# Altium project SUBSYSTEM_A.PrjPcb
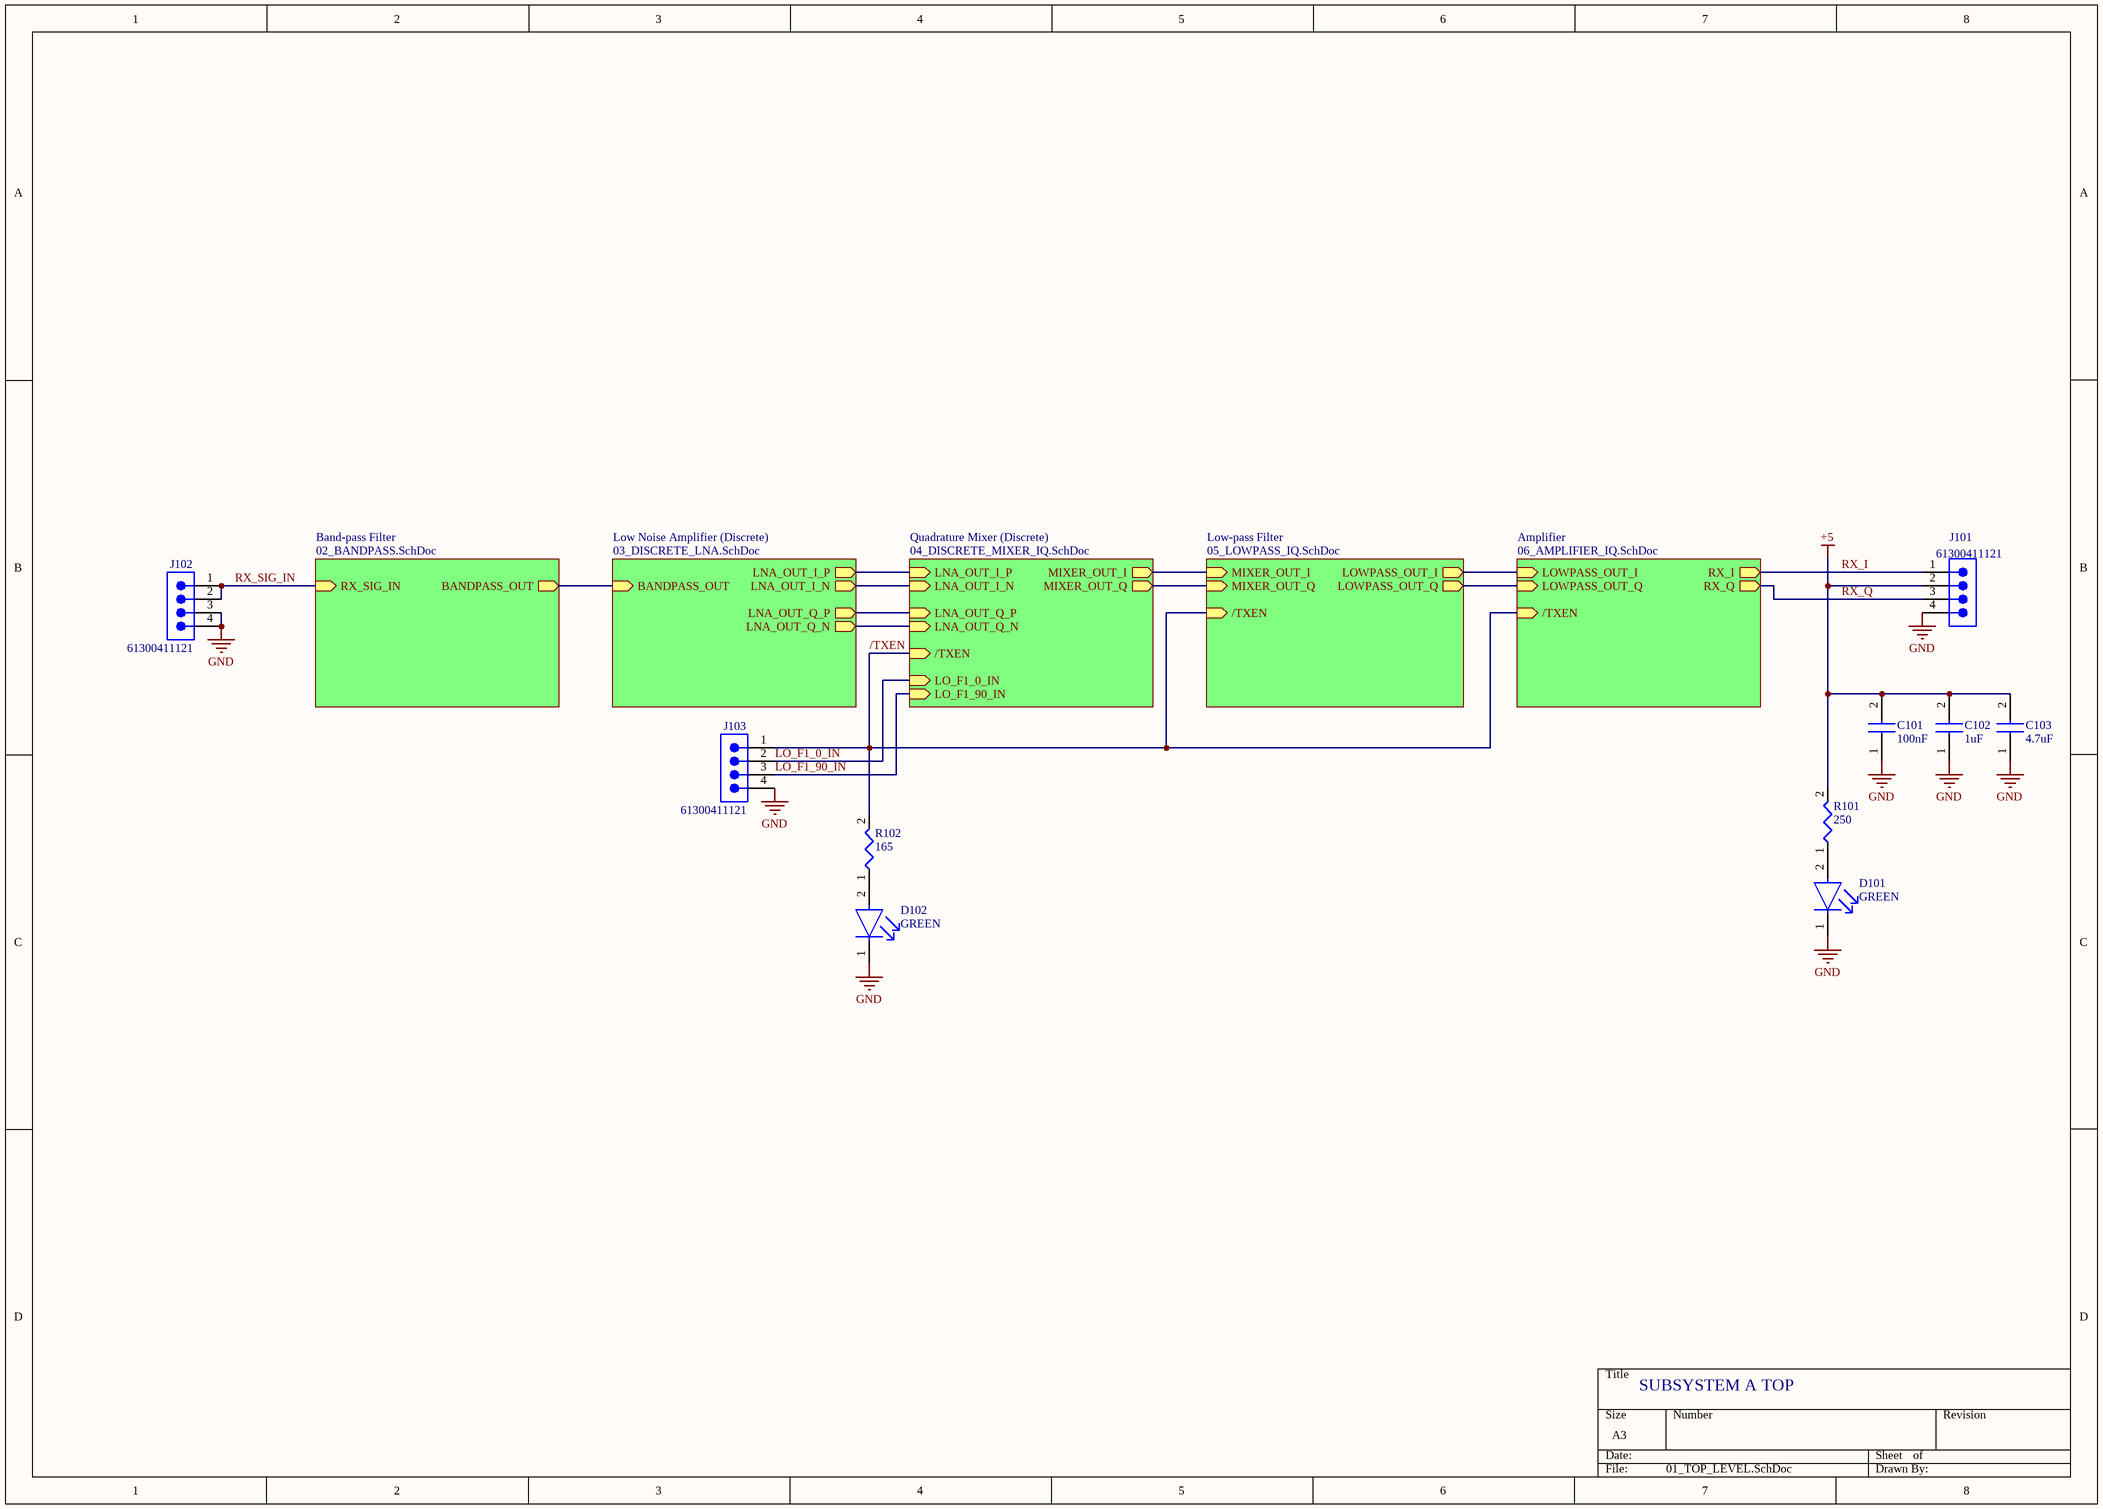
[diagram p0: 01_TOP_LEVEL.SchDoc]
6 sheets, 152 parts. Net scope: hierarchical (ports join the sheet entries above them; power ports are global).
Board file: PCB1.PcbDoc
Sheets:
  01_TOP_LEVEL.SchDoc
    Band-pass Filter = 02_BANDPASS.SchDoc
    Low Noise Amplifier (Discrete) = 03_DISCRETE_LNA.SchDoc
    Quadrature Mixer (Discrete) = 04_DISCRETE_MIXER_IQ.SchDoc
    Low-pass Filter = 05_LOWPASS_IQ.SchDoc
    Amplifier = 06_AMPLIFIER_IQ.SchDoc

## Sheet 01_TOP_LEVEL.SchDoc
size A3; SheetNumber: 1; SheetTotal: 6

### Parts
C101  100nF  [CAP_0805]
C102  1uF  [CAP_0805]
C103  4.7uF  [CAP_0805]
D101  GREEN  [FP-LTST-C170GKT-MFG]
D102  GREEN  [FP-LTST-C170GKT-MFG]
J101  61300411121  [61300411121]
J102  61300411121  [61300411121]
J103  61300411121  [61300411121]
R101  250  [RES_0805]
R102  165  [RES_0805]

### Sub-sheets
Amplifier = 06_AMPLIFIER_IQ.SchDoc: LOWPASS_OUT_I (in), LOWPASS_OUT_Q (in), RX_I (out), RX_Q (out), /TXEN (in)
Band-pass Filter = 02_BANDPASS.SchDoc: BANDPASS_OUT (out), RX_SIG_IN (in)
Low Noise Amplifier (Discrete) = 03_DISCRETE_LNA.SchDoc: BANDPASS_OUT (in), LNA_OUT_I_P (out), LNA_OUT_I_N (out), LNA_OUT_Q_P (out), LNA_OUT_Q_N (out)
Low-pass Filter = 05_LOWPASS_IQ.SchDoc: MIXER_OUT_I (in), MIXER_OUT_Q (in), /TXEN (in), LOWPASS_OUT_I (out), LOWPASS_OUT_Q (out)
Quadrature Mixer (Discrete) = 04_DISCRETE_MIXER_IQ.SchDoc: LNA_OUT_I_P (in), LNA_OUT_I_N (in), LNA_OUT_Q_P (in), LNA_OUT_Q_N (in), MIXER_OUT_I (out), MIXER_OUT_Q (out), LO_F1_0_IN (in), LO_F1_90_IN (in), /TXEN (in)

### Nets
+5: C101.2 C102.2 C103.2 J101.2 R101.2
GND: C101.1 C102.1 C103.1 D101.1(C) D102.1(C) J101.4 J102.3 J102.4 J103.4
/TXEN: J103.1 R102.2 ; sheet Quadrature Mixer (Discrete)//TXEN, sheet Low-pass Filter//TXEN, sheet Amplifier//TXEN
BANDPASS_OUT: sheet Band-pass Filter/BANDPASS_OUT, sheet Low Noise Amplifier (Discrete)/BANDPASS_OUT
LNA_OUT_I_N: sheet Low Noise Amplifier (Discrete)/LNA_OUT_I_N, sheet Quadrature Mixer (Discrete)/LNA_OUT_I_N
LNA_OUT_I_P: sheet Low Noise Amplifier (Discrete)/LNA_OUT_I_P, sheet Quadrature Mixer (Discrete)/LNA_OUT_I_P
LNA_OUT_Q_N: sheet Low Noise Amplifier (Discrete)/LNA_OUT_Q_N, sheet Quadrature Mixer (Discrete)/LNA_OUT_Q_N
LNA_OUT_Q_P: sheet Low Noise Amplifier (Discrete)/LNA_OUT_Q_P, sheet Quadrature Mixer (Discrete)/LNA_OUT_Q_P
LO_F1_0_IN: J103.2 ; sheet Quadrature Mixer (Discrete)/LO_F1_0_IN
LO_F1_90_IN: J103.3 ; sheet Quadrature Mixer (Discrete)/LO_F1_90_IN
LOWPASS_OUT_I: sheet Low-pass Filter/LOWPASS_OUT_I, sheet Amplifier/LOWPASS_OUT_I
LOWPASS_OUT_Q: sheet Low-pass Filter/LOWPASS_OUT_Q, sheet Amplifier/LOWPASS_OUT_Q
MIXER_OUT_I: sheet Quadrature Mixer (Discrete)/MIXER_OUT_I, sheet Low-pass Filter/MIXER_OUT_I
MIXER_OUT_Q: sheet Quadrature Mixer (Discrete)/MIXER_OUT_Q, sheet Low-pass Filter/MIXER_OUT_Q
RX_I: J101.1 ; sheet Amplifier/RX_I
RX_Q: J101.3 ; sheet Amplifier/RX_Q
RX_SIG_IN: J102.1 J102.2 ; sheet Band-pass Filter/RX_SIG_IN
NetD101_2: D101.2(A) R101.1
NetD102_2: D102.2(A) R102.1

### Notes on the sheet
- SUBSYSTEM A TOP

### Library data of the parts
C101-C103 = CAP_0805: Capacitor SMD 0805; Height: 0.94mm
D101 D102 = CMP-1674-00002-6: LED GREEN CLEAR SMD; Dominant Wavelength: 569nm; Lens Style: Diffused; Forward Voltage: 2.1V; Number of Elements: 1; Wavelength: 565nm; Luminous Intensity: 6mcd; Test Current: 10mA; Power Dissipation: 100mW; Reverse Voltage: 5V; Forward Current: 30mA; Viewing Angle: 130°; Lens Color: Colorless; Min Operating Temperature: -55°C; Number of Pins: 2; Max Operating Temperature: 85°C; Color: Green; Radiation Hardening: No; Illumination Color: Green; Case Code (Metric): 2012; Lens Transparency: Clear; Case/Package: 0805; Width: 1.25mm; Case Code (Imperial): 0805; Package Quantity: 1; Height: 1.1mm; Depth: 1.25mm; Length: 2mm; Power Rating: 100mW; Lead Free: Lead Free; Number of LEDs: 1; Packaging: Tape and Reel; Mount: Surface Mount; Voltage: 5V; ComponentLink1Description: DigiKey; ComponentLink1URL: https://www.digikey.ca/en/products/detail/liteon/LTST-C170GKT/269226
J101-J103 = CMP-1502-01064-4: THT Vertical Pin Header WR-PHD, Pitch 2.54 mm, Single Row, 4 pins; Connector Type: Male Pin; Gender: Male; Current Rating: 3A; Number of Positions: 4; Operating Supply Voltage: 250V; Contact Resistance: 20mΩ; Pitch: 2.54mm; Max Operating Temperature: 105°C; Mount: Through Hole; Contact Material: Gold; Contact Plating: Gold; Number of Contacts: 4; Orientation: Vertical; Packaging: Bulk; Contact Mating Length: 5.9944mm; Voltage Rating: 250V; Number of Rows: 1; Height: 8.89mm; Lead Free: Lead Free; Lead Pitch: 2.54mm; Number of Pins: 4; Color: Black; Min Operating Temperature: -40°C; RoHS: Compliant; Termination: Solder; ComponentLink1Description: DigiKey; ComponentLink1URL: https://www.digikey.com/en/products/detail/w%C3%BCrth-elektronik/61300411121/4846827?s=N4IgTCBcDaIGwEYDMAGFAWBWwJAXQF8g
R101 R102 = RES_0805: Resistor SMD 0805

## Sheet 02_BANDPASS.SchDoc
size A3; SheetNumber: 2; SheetTotal: 6
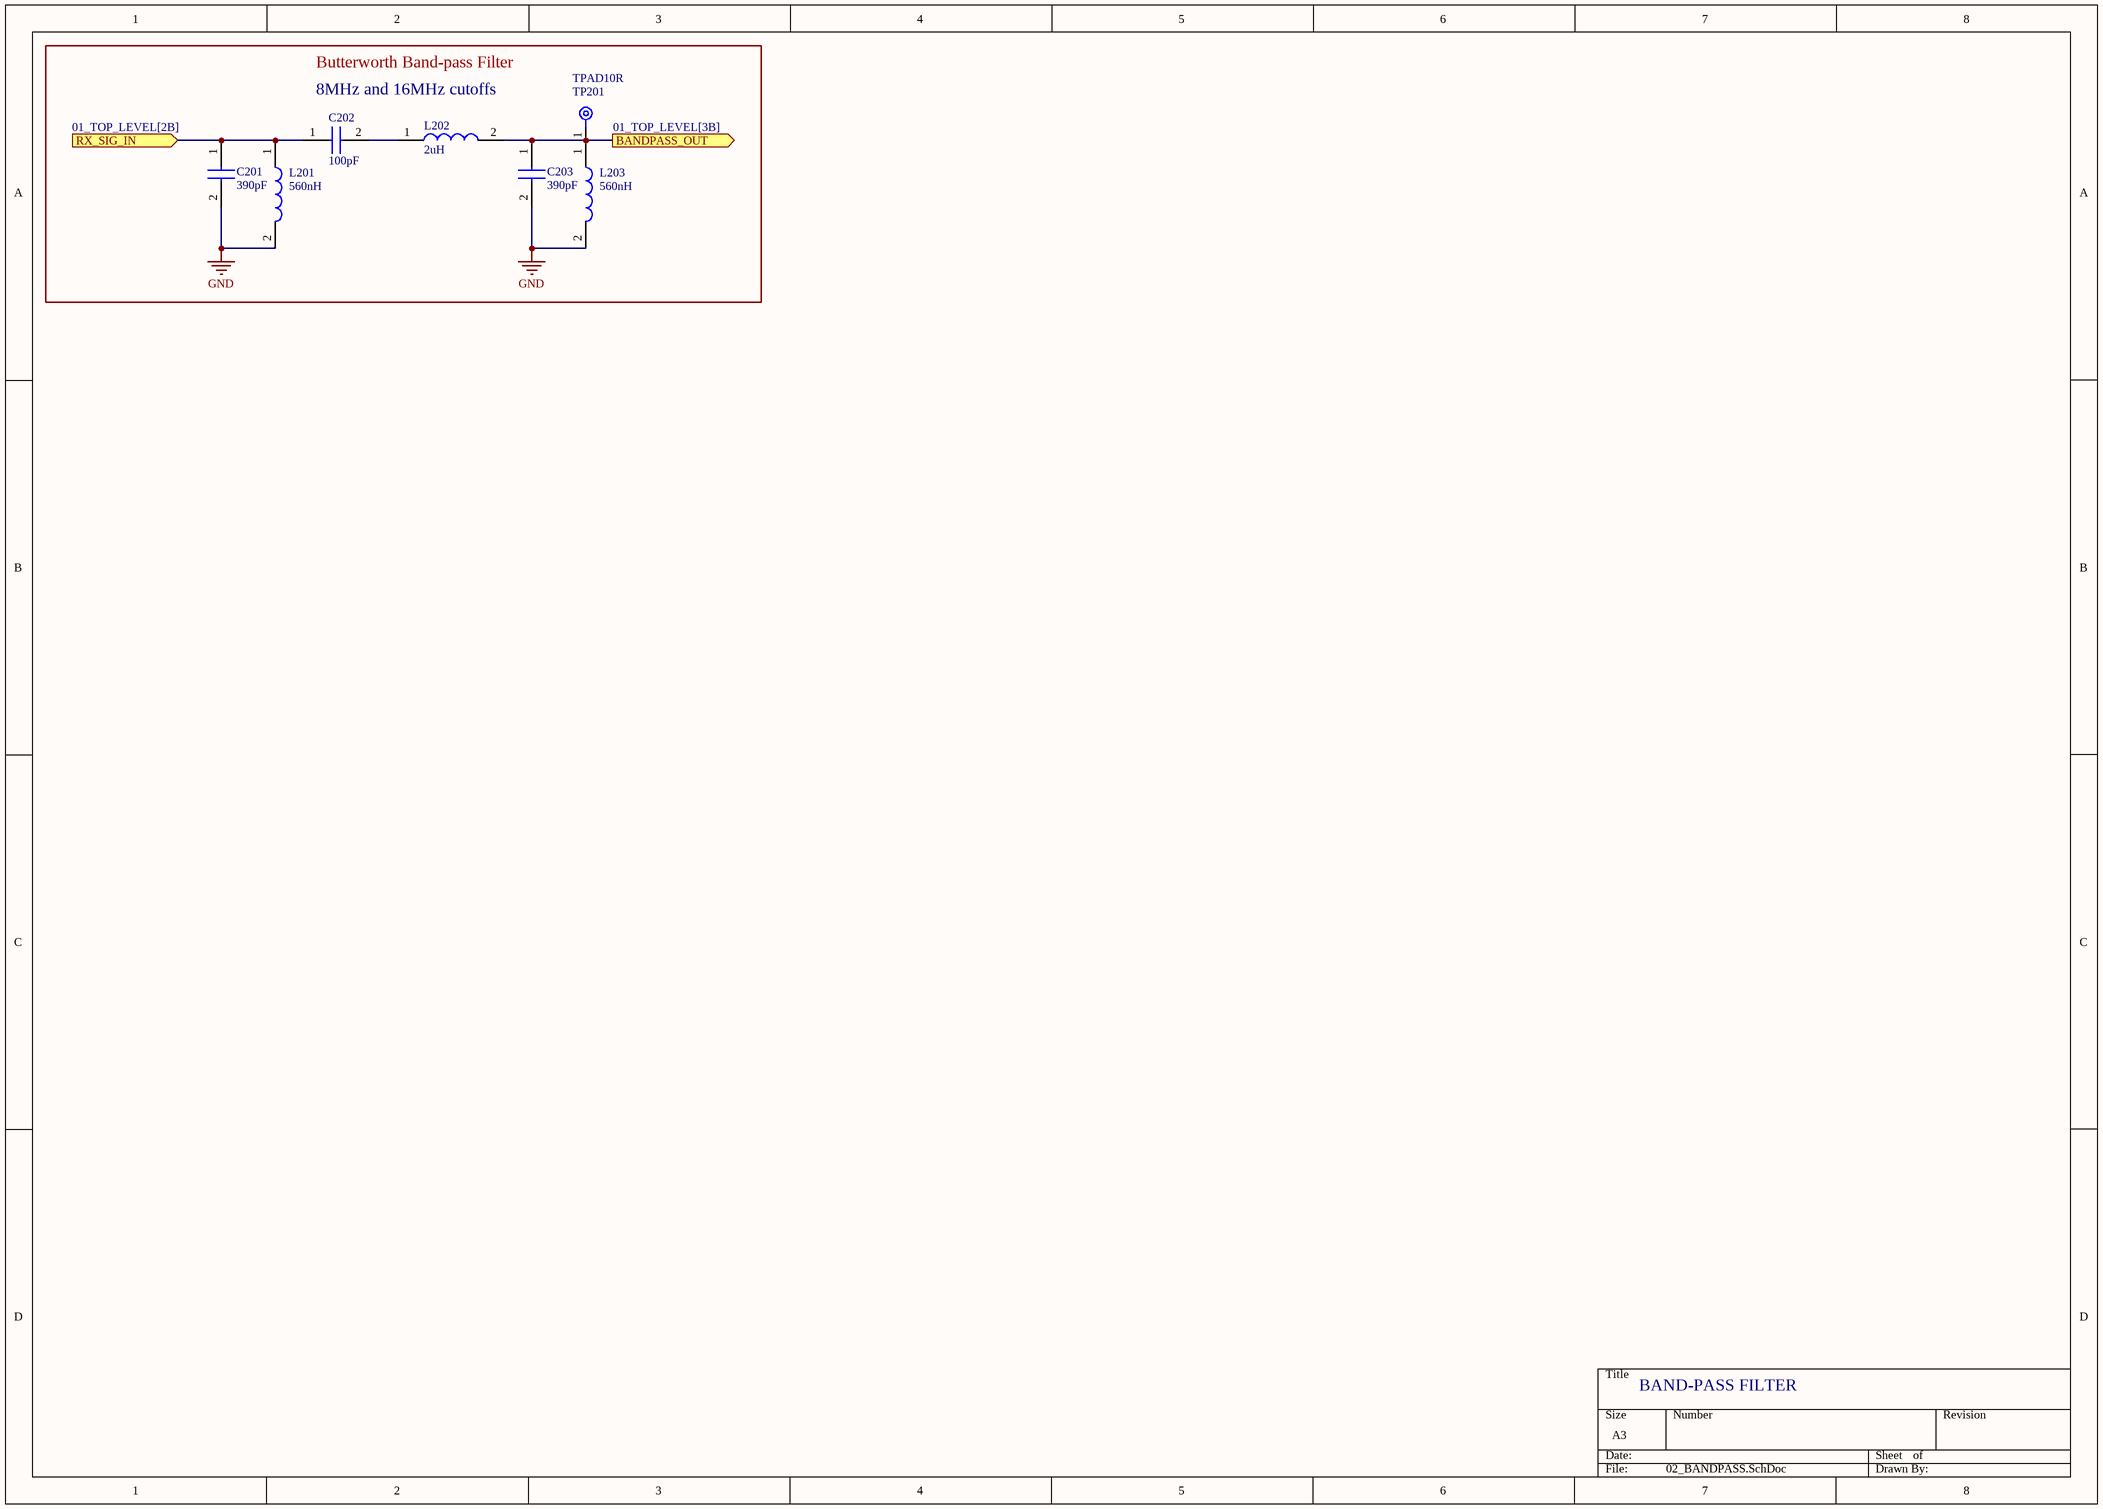
[diagram p1: 02_BANDPASS.SchDoc]

### Parts
C201  390pF  [CAP_0805]
C202  100pF  [CAP_0805]
C203  390pF  [CAP_0805]
L201  560nH  [IND_0805]
L202  2uH  [IND_0805]
L203  560nH  [IND_0805]
TP201  TPAD10R  [TEST_POINT]

### Ports
BANDPASS_OUT (out, see 01_TOP_LEVEL[3B]), RX_SIG_IN (in, see 01_TOP_LEVEL[2B])

### Nets
GND: C201.2 C203.2 L201.2 L203.2
BANDPASS_OUT: C203.1 L202.2 L203.1 TP201.1 ; port BANDPASS_OUT
RX_SIG_IN: C201.1 C202.1 L201.1 ; port RX_SIG_IN
NetC202_2: C202.2 L202.1

### Notes on the sheet
- Butterworth Band-pass Filter
- 8MHz and 16MHz cutoffs
- BAND-PASS FILTER

### Library data of the parts
C201-C203 = CAP_0805: Capacitor SMD 0805; Height: 0.94mm
L201-L203 = IND_0805: Inductor SMD 0805; Manufacturer_Name: Wurth Elektronik; Manufacturer_Part_Number: 74479775147; Height: 1mm; Mouser Part Number: 710-74479775147; Mouser Price/Stock: https://www.mouser.co.uk/ProductDetail/Wurth-Elektronik/74479775147?qs=2kOmHSv6VfSUJsdJ31GFMQ%3D%3D
TP201 = TEST_POINT: Testpont Pad 10R

## Sheet 03_DISCRETE_LNA.SchDoc
size A3; SheetNumber: 3; SheetTotal: 6
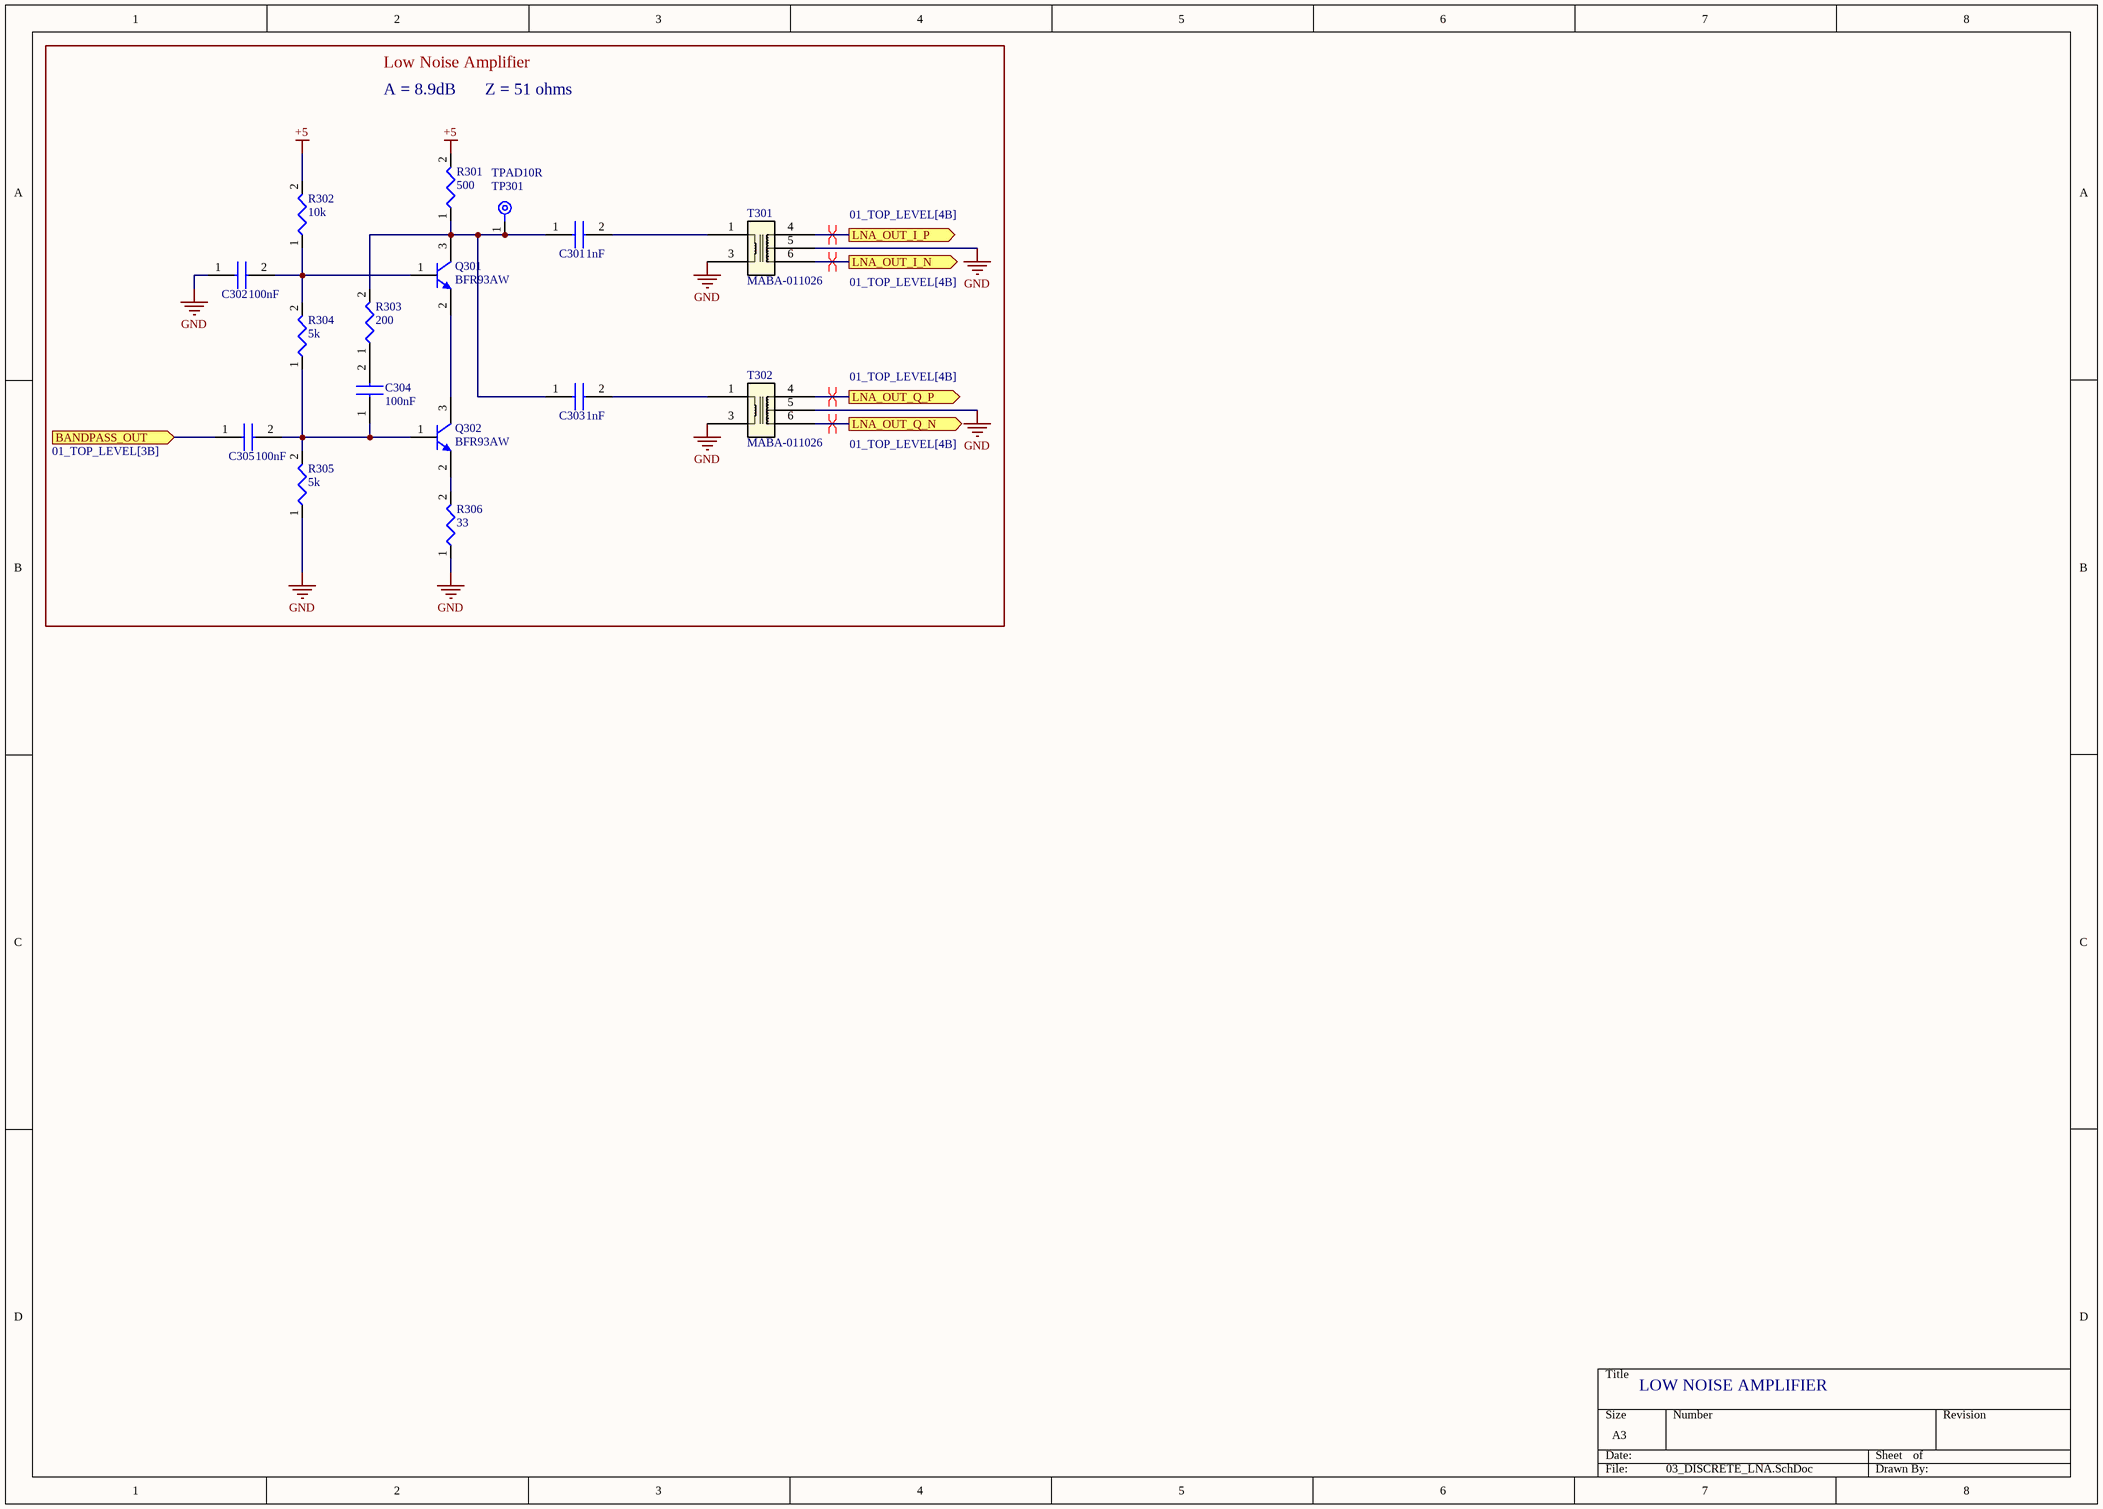
[diagram p2: 03_DISCRETE_LNA.SchDoc]

### Parts
C301  1nF  [CAP_0805]
C302  100nF  [CAP_0805]
C303  1nF  [CAP_0805]
C304  100nF  [CAP_0805]
C305  100nF  [CAP_0805]
Q301  BFR93AW  [INF-SOT323_M]
Q302  BFR93AW  [INF-SOT323_M]
R301  500  [RES_0805]
R302  10k  [RES_0805]
R303  200  [RES_0805]
R304  5k  [RES_0805]
R305  5k  [RES_0805]
R306  33  [RES_0805]
T301  MABA-011026  [MABA-011026_MCM]
T302  MABA-011026  [MABA-011026_MCM]
TP301  TPAD10R  [TEST_POINT]

### Ports
BANDPASS_OUT (in, see 01_TOP_LEVEL[3B]), LNA_OUT_I_N (out, see 01_TOP_LEVEL[4B]), LNA_OUT_I_P (out, see 01_TOP_LEVEL[4B]), LNA_OUT_Q_N (out, see 01_TOP_LEVEL[4B]), LNA_OUT_Q_P (out, see 01_TOP_LEVEL[4B])

### Nets
+5: R301.2 R302.2
GND: C302.1 R305.1 R306.1 T301.3 T301.5 T302.3 T302.5
BANDPASS_OUT: C305.1 ; port BANDPASS_OUT
LNA_OUT_I_N: T301.6 ; port LNA_OUT_I_N
LNA_OUT_I_P: T301.4 ; port LNA_OUT_I_P
LNA_OUT_Q_N: T302.6 ; port LNA_OUT_Q_N
LNA_OUT_Q_P: T302.4 ; port LNA_OUT_Q_P
NetC301_1: C301.1 C303.1 Q301.3(C) R301.1 R303.2 TP301.1
NetC301_2: C301.2 T301.1
NetC302_2: C302.2 Q301.1(B) R302.1 R304.2
NetC303_2: C303.2 T302.1
NetC304_1: C304.1 C305.2 Q302.1(B) R304.1 R305.2
NetC304_2: C304.2 R303.1
NetQ301_2: Q301.2(E) Q302.3(C)
NetQ302_2: Q302.2(E) R306.2

### Layout directives
differential pair: LNA_OUT_I_N, LNA_OUT_I_P, LNA_OUT_Q_N, LNA_OUT_Q_P

### Notes on the sheet
- Low Noise Amplifier
- A = 8.9dB
- Z = 51 ohms
- LOW NOISE AMPLIFIER

### Library data of the parts
C301-C305 = CAP_0805: Capacitor SMD 0805; Height: 0.94mm
Q301 Q302 = CMP-1189-00009-1: NPN Silicon RF Transistor, 12 V VCEO, 90 mA IC, 15.5 dB Gmax, SOT323, Green; Manufacturer: Infineon; IC (max): 90 mA; NFmin (typ): 1.5 dB; Gmax (typ): 15.5 dB; Group: For low frequencies, e.g. VHF/UHF; VCEO (max): 12 V; Ptot (max): 300mW; Green: yes; ComponentLink3Description: Package Specification; PartNumber: BFR93AW; ComponentLink2URL: http://www.infineon.com/dgdl/Infineon_LNA_BFR93AW.pdf?folderId=db3a30431400ef68011425b1354605c1&fileId=db3a30431441fb5d0114acaaec8c148f&location=en.Products.RF.RF_Transistors_.High_Linearity_Si-_and_SiGe_C-Transistors_for_use_up_to_6_GHz.DATASHEET.Infineon; ComponentLink3URL: http://www.infineon.com/dgdl/SOT323-Package_Overview.pdf?folderId=db3a30431936bc4b0119533e1dcb3c92&fileId=db3a30431936bc4b011953495f283cb1; ComponentLink2Description: Datasheet; Halogen-free: yes; ComponentLink1URL: http://www.infineon.com/; PackageReference: SOT323; PackageDescription: 3-Pin Small Outline Transistor Package, 1.25 x 2 mm Body, 0.65 mm Pitch; ComponentLink1Description: Manufacturer URL; Mounting Technology: Surface Mount; DatasheetVersion: Jul-2012; ComponentLink4Description: DigiKey; ComponentLink4URL: https://www.digikey.com/en/products/detail/infineon-technologies/BFR93AWH6327XTSA1/2337797
R301-R306 = RES_0805: Resistor SMD 0805
T301 T302 = MABA-011026: RF Transformer; Manufacturer_Name: MACOM; Frequency Range: 2MHz ~ 200MHz; Impedance: 1:1; Insertion Loss: 1.0dB; Return Loss: 12.0dB; Phase Difference: 0.5°; Copyright: Copyright (C) 2025 Ultra Librarian. All rights reserved.; Manufacturer_Part_Number: MABA-011026; Data Sheet: https://cdn.macom.com/datasheets/MABA-011026.pdf; Package: SMD; ComponentLink1Description: DigiKey; ComponentLink1URL: https://www.digikey.com/en/products/detail/macom-technology-solutions/MABA-011026/12757346
TP301 = TEST_POINT: Testpont Pad 10R

## Sheet 04_DISCRETE_MIXER_IQ.SchDoc
size A3; SheetNumber: 4; SheetTotal: 6
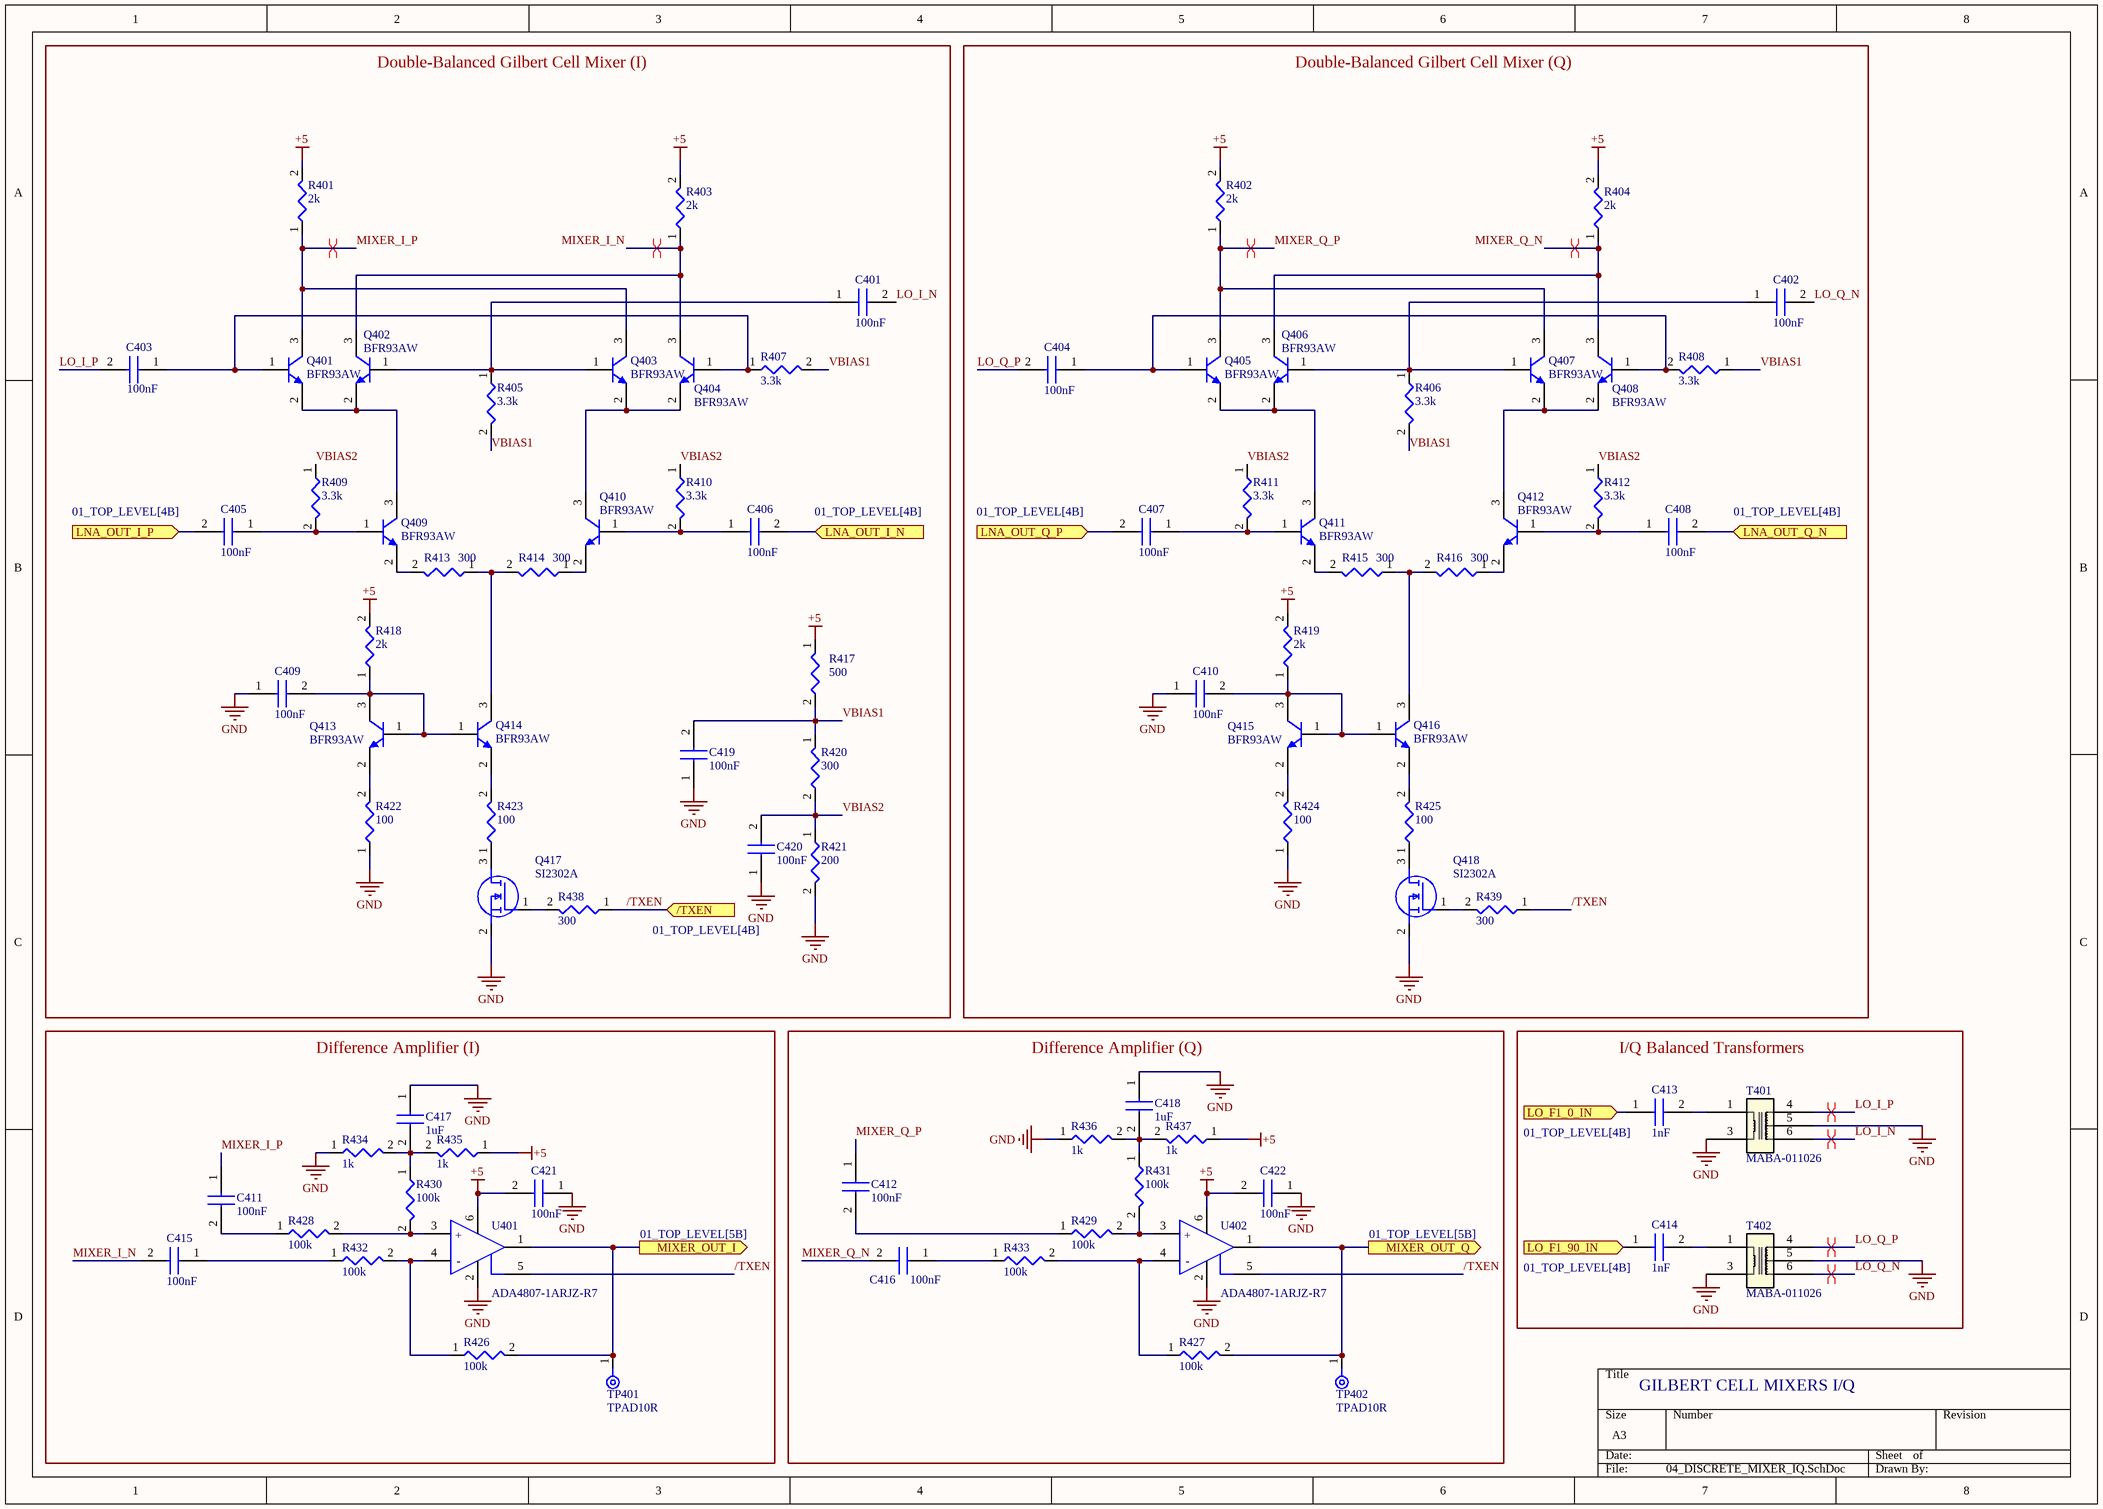
[diagram p3: 04_DISCRETE_MIXER_IQ.SchDoc]

### Parts
C401  100nF  [CAP_0805]
C402  100nF  [CAP_0805]
C403  100nF  [CAP_0805]
C404  100nF  [CAP_0805]
C405  100nF  [CAP_0805]
C406  100nF  [CAP_0805]
C407  100nF  [CAP_0805]
C408  100nF  [CAP_0805]
C409  100nF  [CAP_0805]
C410  100nF  [CAP_0805]
C411  100nF  [CAP_0805]
C412  100nF  [CAP_0805]
C413  1nF  [CAP_0805]
C414  1nF  [CAP_0805]
C415  100nF  [CAP_0805]
C416  100nF  [CAP_0805]
C417  1uF  [CAP_0805]
C418  1uF  [CAP_0805]
C419  100nF  [CAP_0805]
C420  100nF  [CAP_0805]
C421  100nF  [CAP_0805]
C422  100nF  [CAP_0805]
Q401  BFR93AW  [INF-SOT323_M]
Q402  BFR93AW  [INF-SOT323_M]
Q403  BFR93AW  [INF-SOT323_M]
Q404  BFR93AW  [INF-SOT323_M]
Q405  BFR93AW  [INF-SOT323_M]
Q406  BFR93AW  [INF-SOT323_M]
Q407  BFR93AW  [INF-SOT323_M]
Q408  BFR93AW  [INF-SOT323_M]
Q409  BFR93AW  [INF-SOT323_M]
Q410  BFR93AW  [INF-SOT323_M]
Q411  BFR93AW  [INF-SOT323_M]
Q412  BFR93AW  [INF-SOT323_M]
Q413  BFR93AW  [INF-SOT323_M]
Q414  BFR93AW  [INF-SOT323_M]
Q415  BFR93AW  [INF-SOT323_M]
Q416  BFR93AW  [INF-SOT323_M]
Q417  SI2302A  [SOT95P237X112-3N]
Q418  SI2302A  [SOT95P237X112-3N]
R401  2k  [RES_0805]
R402  2k  [RES_0805]
R403  2k  [RES_0805]
R404  2k  [RES_0805]
R405  3.3k  [RES_0805]
R406  3.3k  [RES_0805]
R407  3.3k  [RES_0805]
R408  3.3k  [RES_0805]
R409  3.3k  [RES_0805]
R410  3.3k  [RES_0805]
R411  3.3k  [RES_0805]
R412  3.3k  [RES_0805]
R413  300  [RES_0805]
R414  300  [RES_0805]
R415  300  [RES_0805]
R416  300  [RES_0805]
R417  500  [RES_0805]
R418  2k  [RES_0805]
R419  2k  [RES_0805]
R420  300  [RES_0805]
R421  200  [RES_0805]
R422  100  [RES_0805]
R423  100  [RES_0805]
R424  100  [RES_0805]
R425  100  [RES_0805]
R426  100k  [RES_0805]
R427  100k  [RES_0805]
R428  100k  [RES_0805]
R429  100k  [RES_0805]
R430  100k  [RES_0805]
R431  100k  [RES_0805]
R432  100k  [RES_0805]
R433  100k  [RES_0805]
R434  1k  [RES_0805]
R435  1k  [RES_0805]
R436  1k  [RES_0805]
R437  1k  [RES_0805]
R438  300  [RES_0805]
R439  300  [RES_0805]
T401  MABA-011026  [MABA-011026_MCM]
T402  MABA-011026  [MABA-011026_MCM]
TP401  TPAD10R  [TEST_POINT]
TP402  TPAD10R  [TEST_POINT]
U401  ADA4807-1ARJZ-R7  [FP-RJ-6-IPC_A]
U402  ADA4807-1ARJZ-R7  [FP-RJ-6-IPC_A]

### Blocks framed on the sheet
Double-Balanced Gilbert Cell Mixer (I): C401 C403 C405 C406 C409 C419 C420 Q401-Q404 Q409 Q410 Q413 Q414 Q417 R401 R403 R405 R407 R409 R410 R413 R414 R417 R418 R420-R423 R438
Double-Balanced Gilbert Cell Mixer (Q): C402 C404 C407 C408 C410 Q405-Q408 Q411 Q412 Q415 Q416 Q418 R402 R404 R406 R408 R411 R412 R415 R416 R419 R424 R425 R439
Difference Amplifier (I): C411 C415 C417 C421 R426 R428 R430 R432 R434 R435 TP401 U401
Difference Amplifier (Q): C412 C416 C418 C422 R427 R429 R431 R433 R436 R437 TP402 U402
I/Q Balanced Transformers: C413 C414 T401 T402

### Ports
/TXEN (in, see 01_TOP_LEVEL[4B]), LNA_OUT_I_N (in, see 01_TOP_LEVEL[4B]), LNA_OUT_I_P (in, see 01_TOP_LEVEL[4B]), LNA_OUT_Q_N (in, see 01_TOP_LEVEL[4B]), LNA_OUT_Q_P (in, see 01_TOP_LEVEL[4B]), LO_F1_0_IN (in, see 01_TOP_LEVEL[4B]), LO_F1_90_IN (in, see 01_TOP_LEVEL[4B]), MIXER_OUT_I (out, see 01_TOP_LEVEL[5B]), MIXER_OUT_Q (out, see 01_TOP_LEVEL[5B])

### Nets
+5: C421.2 C422.2 R401.2 R402.2 R403.2 R404.2 R417.1 R418.2 R419.2 R435.1 R437.1 U401.6(+VS) U402.6(+VS)
GND: C409.1 C410.1 C417.1 C418.1 C419.1 C420.1 C421.1 C422.1 Q417.2(S) Q418.2(S) R421.2 R422.1 R424.1 R434.1 R436.1 T401.3 T401.5 T402.3 T402.5 U401.2(-VS) U402.2(-VS)
/TXEN: R438.1 R439.1 U401.5(~{DISABLE}) U402.5(~{DISABLE}) ; port /TXEN
LNA_OUT_I_N: C406.2 ; port LNA_OUT_I_N
LNA_OUT_I_P: C405.2 ; port LNA_OUT_I_P
LNA_OUT_Q_N: C408.2 ; port LNA_OUT_Q_N
LNA_OUT_Q_P: C407.2 ; port LNA_OUT_Q_P
LO_F1_0_IN: C413.1 ; port LO_F1_0_IN
LO_F1_90_IN: C414.1 ; port LO_F1_90_IN
LO_I_N: C401.2 T401.6
LO_I_P: C403.2 T401.4
LO_Q_N: C402.2 T402.6
LO_Q_P: C404.2 T402.4
MIXER_I_N: C415.2 Q402.3(C) Q404.3(C) R403.1
MIXER_I_P: C411.1 Q401.3(C) Q403.3(C) R401.1
MIXER_OUT_I: R426.2 TP401.1 U401.1(VOUT) ; port MIXER_OUT_I
MIXER_OUT_Q: R427.2 TP402.1 U402.1(VOUT) ; port MIXER_OUT_Q
MIXER_Q_N: C416.2 Q406.3(C) Q408.3(C) R404.1
MIXER_Q_P: C412.1 Q405.3(C) Q407.3(C) R402.1
VBIAS1: C419.2 R405.2 R406.2 R407.2 R408.1 R417.2 R420.1
VBIAS2: C420.2 R409.1 R410.1 R411.1 R412.1 R420.2 R421.1
NetC401_1: C401.1 Q402.1(B) Q403.1(B) R405.1
NetC402_1: C402.1 Q406.1(B) Q407.1(B) R406.1
NetC403_1: C403.1 Q401.1(B) Q404.1(B) R407.1
NetC404_1: C404.1 Q405.1(B) Q408.1(B) R408.2
NetC405_1: C405.1 Q409.1(B) R409.2
NetC406_1: C406.1 Q410.1(B) R410.2
NetC407_1: C407.1 Q411.1(B) R411.2
NetC408_1: C408.1 Q412.1(B) R412.2
NetC409_2: C409.2 Q413.1(B) Q413.3(C) Q414.1(B) R418.1
NetC410_2: C410.2 Q415.1(B) Q415.3(C) Q416.1(B) R419.1
NetC411_2: C411.2 R428.1
NetC412_2: C412.2 R429.1
NetC413_2: C413.2 T401.1
NetC414_2: C414.2 T402.1
NetC415_1: C415.1 R432.1
NetC416_1: C416.1 R433.1
NetC417_2: C417.2 R430.1 R434.2 R435.2
NetC418_2: C418.2 R431.1 R436.2 R437.2
NetQ401_2: Q401.2(E) Q402.2(E) Q409.3(C)
NetQ403_2: Q403.2(E) Q404.2(E) Q410.3(C)
NetQ405_2: Q405.2(E) Q406.2(E) Q411.3(C)
NetQ407_2: Q407.2(E) Q408.2(E) Q412.3(C)
NetQ409_2: Q409.2(E) R413.2
NetQ410_2: Q410.2(E) R414.1
NetQ411_2: Q411.2(E) R415.2
NetQ412_2: Q412.2(E) R416.1
NetQ413_2: Q413.2(E) R422.2
NetQ414_2: Q414.2(E) R423.2
NetQ414_3: Q414.3(C) R413.1 R414.2
NetQ415_2: Q415.2(E) R424.2
NetQ416_2: Q416.2(E) R425.2
NetQ416_3: Q416.3(C) R415.1 R416.2
NetQ417_1: Q417.1(G) R438.2
NetQ417_3: Q417.3(D) R423.1
NetQ418_1: Q418.1(G) R439.2
NetQ418_3: Q418.3(D) R425.1
NetR426_1: R426.1 R432.2 U401.4(-IN)
NetR427_1: R427.1 R433.2 U402.4(-IN)
NetR428_2: R428.2 R430.2 U401.3(+IN)
NetR429_2: R429.2 R431.2 U402.3(+IN)

### Layout directives
differential pair: LO_I_N, LO_I_P, LO_Q_N, LO_Q_P, MIXER_I_N, MIXER_I_P, MIXER_Q_N, MIXER_Q_P

### Notes on the sheet
- GILBERT CELL MIXERS I/Q
- (in symbol CMP-09116-000179-1) +; -

### Library data of the parts
C401-C422 = CAP_0805: Capacitor SMD 0805; Height: 0.94mm
Q401-Q416 = CMP-1189-00009-1: as Q301 on sheet 03_DISCRETE_LNA; ComponentLink3Description: Package Specification; PartNumber: BFR93AW; ComponentLink2URL: http://www.infineon.com/dgdl/Infineon_LNA_BFR93AW.pdf?folderId=db3a30431400ef68011425b1354605c1&fileId=db3a30431441fb5d0114acaaec8c148f&location=en.Products.RF.RF_Transistors_.High_Linearity_Si-_and_SiGe_C-Transistors_for_use_up_to_6_GHz.DATASHEET.Infineon; ComponentLink3URL: http://www.infineon.com/dgdl/SOT323-Package_Overview.pdf?folderId=db3a30431936bc4b0119533e1dcb3c92&fileId=db3a30431936bc4b011953495f283cb1; ComponentLink2Description: Datasheet; Halogen-free: yes; ComponentLink1URL: http://www.infineon.com/; PackageReference: SOT323; PackageDescription: 3-Pin Small Outline Transistor Package, 1.25 x 2 mm Body, 0.65 mm Pitch; ComponentLink1Description: Manufacturer URL; Mounting Technology: Surface Mount; DatasheetVersion: Jul-2012; ComponentLink4Description: DigiKey; ComponentLink4URL: https://www.digikey.com/en/products/detail/infineon-technologies/BFR93AWH6327XTSA1/2337797
Q417 Q418 = SI2302ADS: MOSFET (N-Channel); Manufacturer_Name: UMW; Datasheet Link: https://mm.digikey.com/Volume0/opasdata/d220001/medias/docus/2593/UMW%20SI2302A.pdf; Height: 1.12mm; Manufacturer_Part_Number: SI2302A; ComponentLink2Description: DigiKey; ComponentLink2URL: https://www.digikey.com/en/products/detail/umw/SI2302A/16705922
R401-R439 = RES_0805: Resistor SMD 0805
T401 T402 = MABA-011026: as T301 on sheet 03_DISCRETE_LNA; Copyright: Copyright (C) 2025 Ultra Librarian. All rights reserved.; Manufacturer_Part_Number: MABA-011026; Data Sheet: https://cdn.macom.com/datasheets/MABA-011026.pdf; Package: SMD; ComponentLink1Description: DigiKey; ComponentLink1URL: https://www.digikey.com/en/products/detail/macom-technology-solutions/MABA-011026/12757346
TP401 TP402 = TEST_POINT: Testpont Pad 10R
U401 U402 = CMP-09116-000179-1: IC OPAMP VFB 1 CIRCUIT SOT23-6; -3db Bandwidth: 180MHz; Max Frequency: 100kHz; Bandwidth: 200MHz; Min Supply Voltage: 3V; Max Input Voltage: 11V; Common Mode Rejection Ratio: 96dB; Power Supply Rejection Ratio (PSRR): 105dB; Output Current: 60mA; Input Offset Voltage (Vos): 20uV; Output Current per Channel: 106mA; Number of Circuits: 1; Min Input Voltage: 2.7V; Operating Supply Voltage: 10V; Input Bias Current: 1.2uA; Operating Supply Current: 950uA; Voltage Gain: 130dB; Slew Rate: 225V/µs; Dual Supply Voltage: 5V; Height: 1.3mm; Min Operating Temperature: -40°C; Mount: Surface Mount; Lead Free: Contains Lead; Gain Bandwidth Product: 200MHz; Contact Plating: Tin; Width: 1.7mm; Packaging: Cut Tape; Max Operating Temperature: 125°C; Case/Package: SOT-23-6; Number of Pins: 6; Length: 3mm; REACH SVHC: No SVHC; Max Supply Voltage: 11V; RoHS Compliant: Yes; Number of Amplifiers: 1; ComponentLink1Description: DigiKey; ComponentLink1URL: https://www.digikey.com/en/products/detail/analog-devices-inc/ADA4807-1ARJZ-R2/5057389

## Sheet 05_LOWPASS_IQ.SchDoc
size A3; SheetNumber: 5; SheetTotal: 6
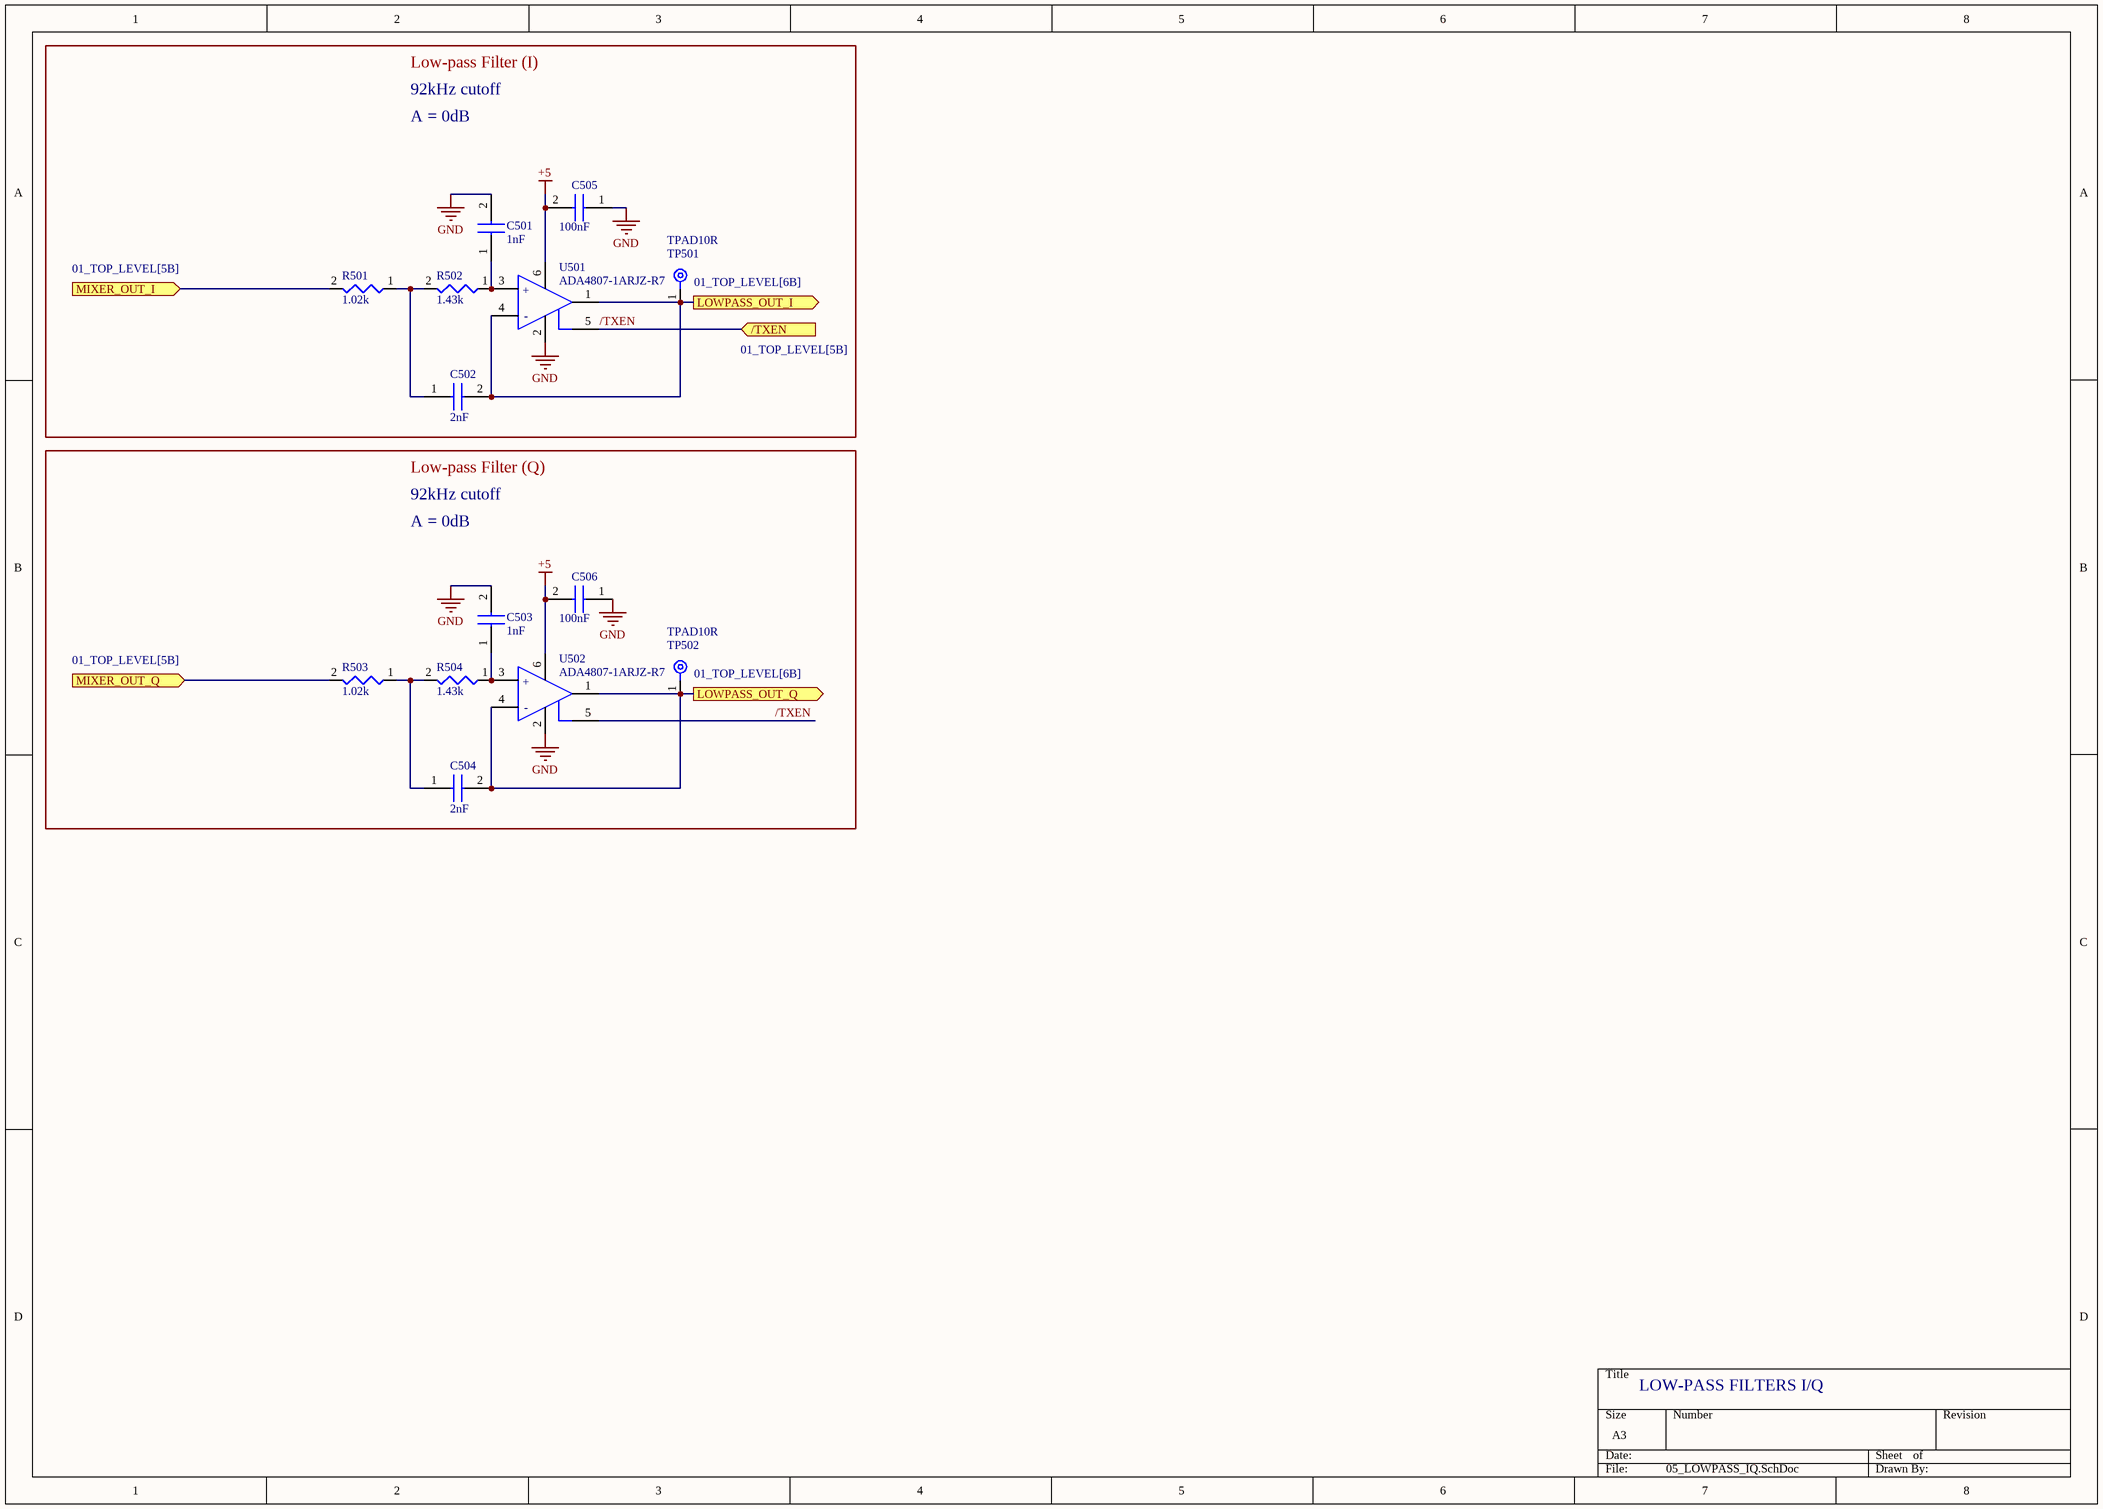
[diagram p4: 05_LOWPASS_IQ.SchDoc]

### Parts
C501  1nF  [CAP_0805]
C502  2nF  [CAP_0805]
C503  1nF  [CAP_0805]
C504  2nF  [CAP_0805]
C505  100nF  [CAP_0805]
C506  100nF  [CAP_0805]
R501  1.02k  [RES_0805]
R502  1.43k  [RES_0805]
R503  1.02k  [RES_0805]
R504  1.43k  [RES_0805]
TP501  TPAD10R  [TEST_POINT]
TP502  TPAD10R  [TEST_POINT]
U501  ADA4807-1ARJZ-R7  [FP-RJ-6-IPC_A]
U502  ADA4807-1ARJZ-R7  [FP-RJ-6-IPC_A]

### Ports
/TXEN (in, see 01_TOP_LEVEL[5B]), LOWPASS_OUT_I (out, see 01_TOP_LEVEL[6B]), LOWPASS_OUT_Q (out, see 01_TOP_LEVEL[6B]), MIXER_OUT_I (in, see 01_TOP_LEVEL[5B]), MIXER_OUT_Q (in, see 01_TOP_LEVEL[5B])

### Nets
+5: C505.2 C506.2 U501.6(+VS) U502.6(+VS)
GND: C501.2 C503.2 C505.1 C506.1 U501.2(-VS) U502.2(-VS)
/TXEN: U501.5(~{DISABLE}) U502.5(~{DISABLE}) ; port /TXEN
LOWPASS_OUT_I: C502.2 TP501.1 U501.1(VOUT) U501.4(-IN) ; port LOWPASS_OUT_I
LOWPASS_OUT_Q: C504.2 TP502.1 U502.1(VOUT) U502.4(-IN) ; port LOWPASS_OUT_Q
MIXER_OUT_I: R501.2 ; port MIXER_OUT_I
MIXER_OUT_Q: R503.2 ; port MIXER_OUT_Q
NetC501_1: C501.1 R502.1 U501.3(+IN)
NetC502_1: C502.1 R501.1 R502.2
NetC503_1: C503.1 R504.1 U502.3(+IN)
NetC504_1: C504.1 R503.1 R504.2

### Notes on the sheet
- Low-pass Filter (I)
- 92kHz cutoff
- A = 0dB
- Low-pass Filter (Q)
- LOW-PASS FILTERS I/Q
- (in symbol CMP-09116-000179-1) +; -

### Library data of the parts
C501-C506 = CAP_0805: Capacitor SMD 0805; Height: 0.94mm
R501-R504 = RES_0805: Resistor SMD 0805
TP501 TP502 = TEST_POINT: Testpont Pad 10R
U501 U502 = CMP-09116-000179-1: as U401 on sheet 04_DISCRETE_MIXER_IQ; Height: 1.3mm; Min Operating Temperature: -40°C; Mount: Surface Mount; Lead Free: Contains Lead; Gain Bandwidth Product: 200MHz; Contact Plating: Tin; Width: 1.7mm; Packaging: Cut Tape; Max Operating Temperature: 125°C; Case/Package: SOT-23-6; Number of Pins: 6; Length: 3mm; REACH SVHC: No SVHC; Max Supply Voltage: 11V; RoHS Compliant: Yes; Number of Amplifiers: 1; ComponentLink1Description: DigiKey; ComponentLink1URL: https://www.digikey.com/en/products/detail/analog-devices-inc/ADA4807-1ARJZ-R2/5057389

## Sheet 06_AMPLIFIER_IQ.SchDoc
size A3; SheetNumber: 6; SheetTotal: 6
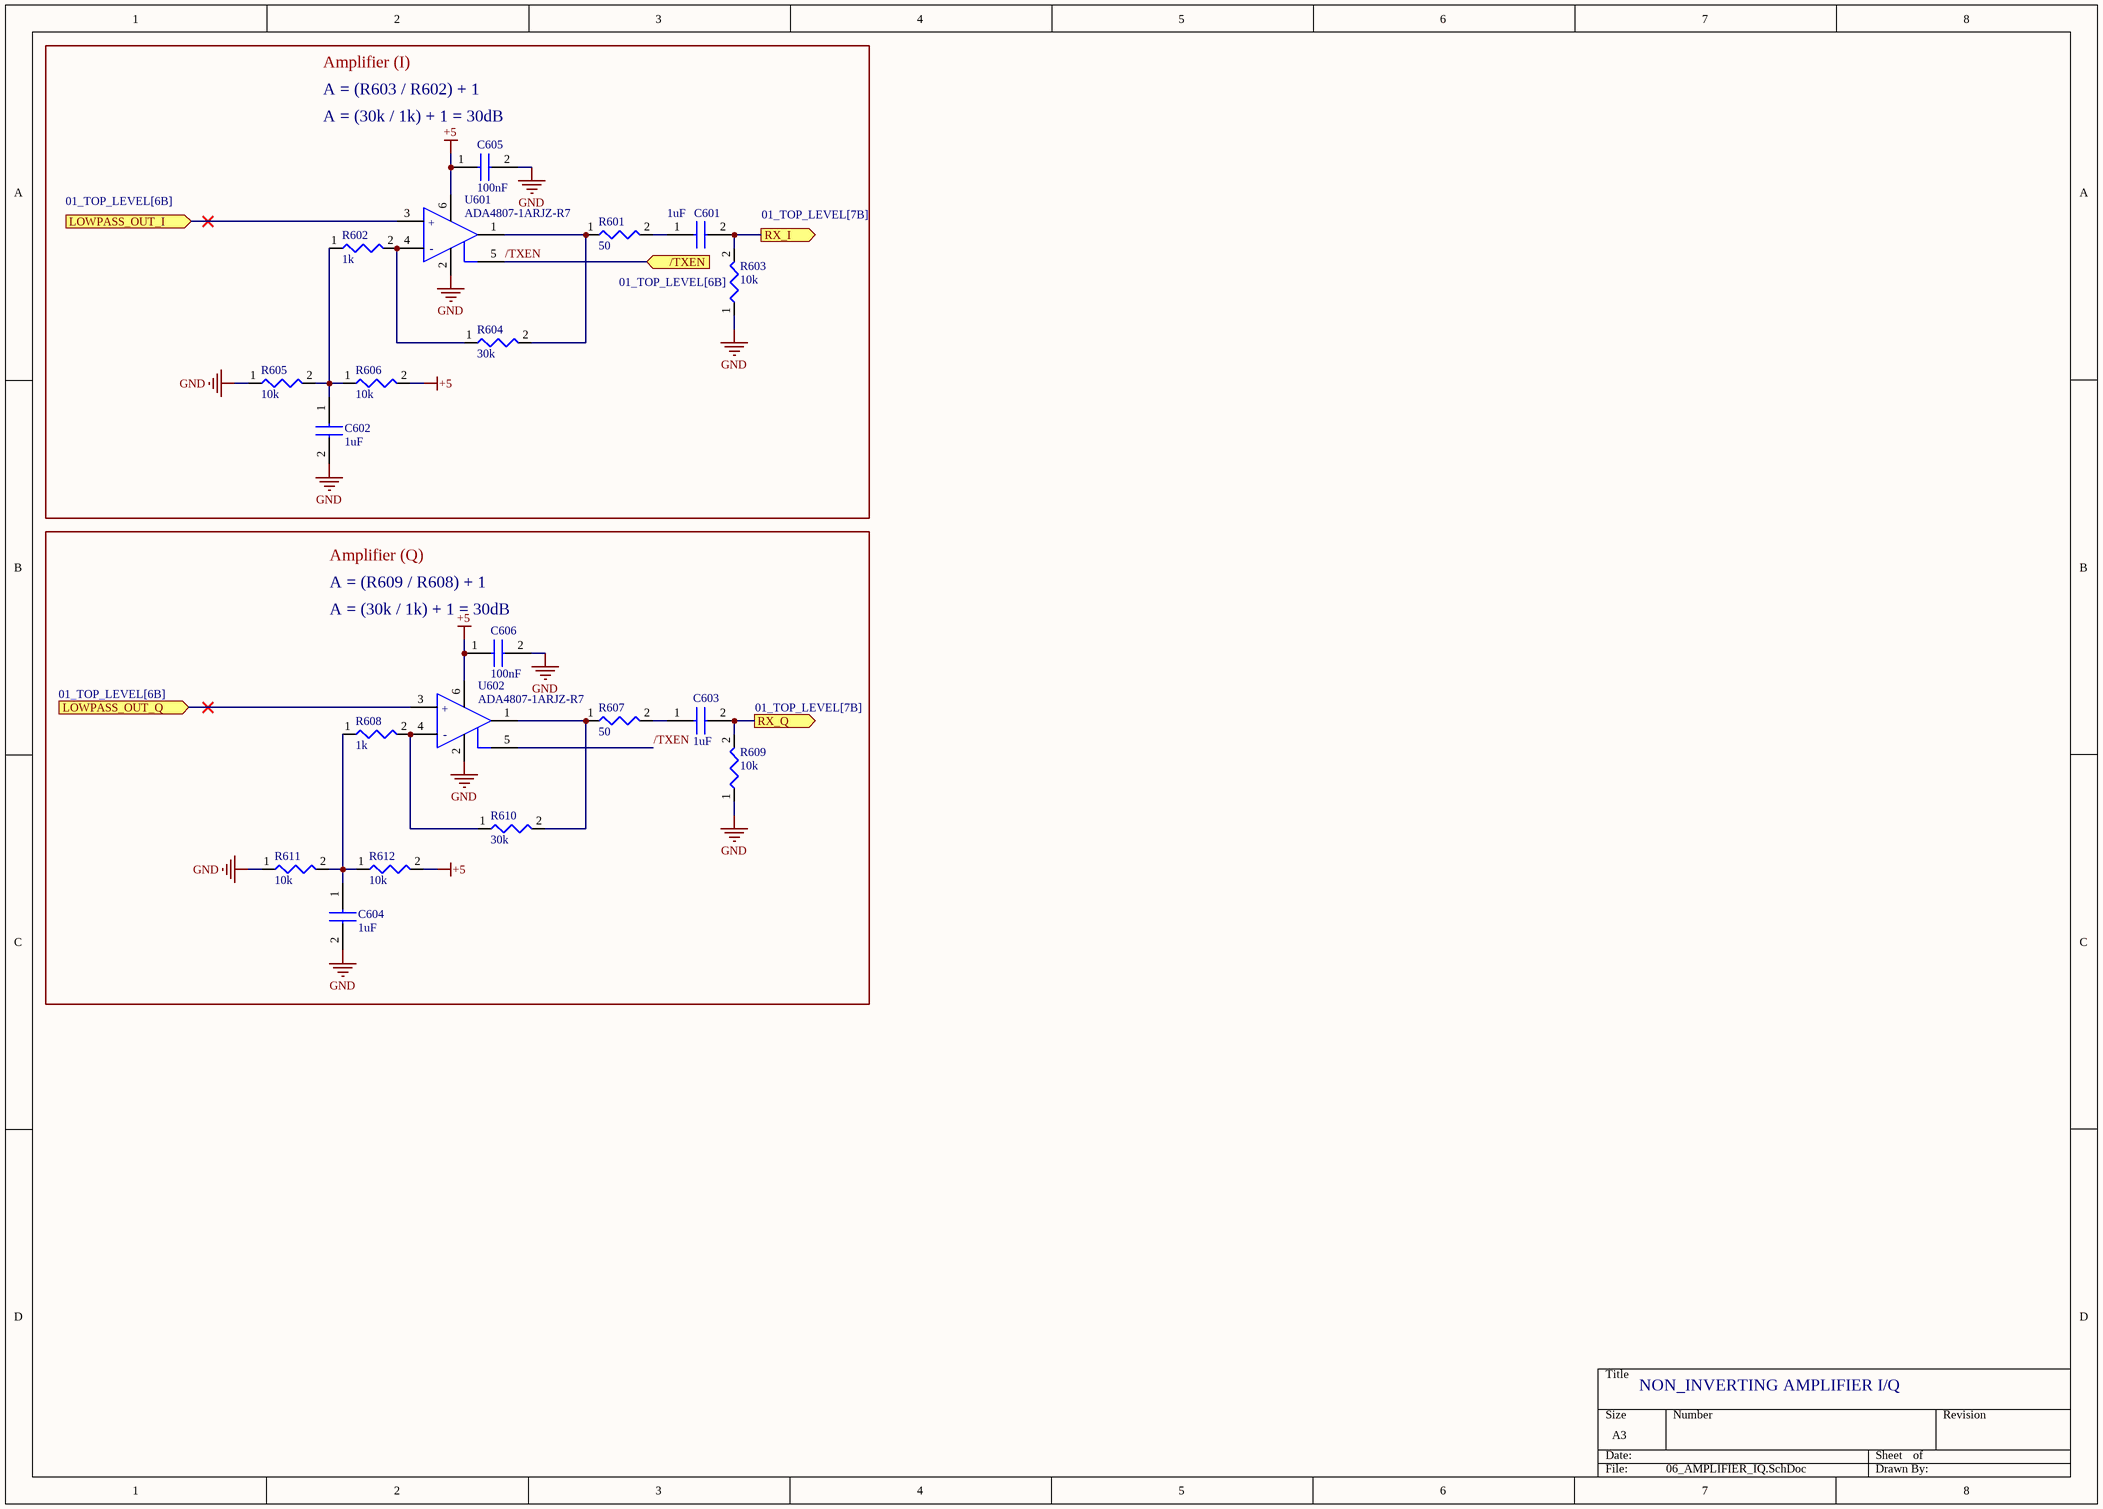
[diagram p5: 06_AMPLIFIER_IQ.SchDoc]

### Parts
C601  1uF  [CAP_0805]
C602  1uF  [CAP_0805]
C603  1uF  [CAP_0805]
C604  1uF  [CAP_0805]
C605  100nF  [CAP_0805]
C606  100nF  [CAP_0805]
R601  50  [RES_0805]
R602  1k  [RES_0805]
R603  10k  [RES_0805]
R604  30k  [RES_0805]
R605  10k  [RES_0805]
R606  10k  [RES_0805]
R607  50  [RES_0805]
R608  1k  [RES_0805]
R609  10k  [RES_0805]
R610  30k  [RES_0805]
R611  10k  [RES_0805]
R612  10k  [RES_0805]
U601  ADA4807-1ARJZ-R7  [FP-RJ-6-IPC_A]
U602  ADA4807-1ARJZ-R7  [FP-RJ-6-IPC_A]

### Ports
/TXEN (in, see 01_TOP_LEVEL[6B]), LOWPASS_OUT_I (in, see 01_TOP_LEVEL[6B]), LOWPASS_OUT_Q (in, see 01_TOP_LEVEL[6B]), RX_I (out, see 01_TOP_LEVEL[7B]), RX_Q (out, see 01_TOP_LEVEL[7B])

### Nets
+5: C605.1 C606.1 R606.2 R612.2 U601.6(+VS) U602.6(+VS)
GND: C602.2 C604.2 C605.2 C606.2 R603.1 R605.1 R609.1 R611.1 U601.2(-VS) U602.2(-VS)
/TXEN: U601.5(~{DISABLE}) U602.5(~{DISABLE}) ; port /TXEN
LOWPASS_OUT_I: U601.3(+IN) ; port LOWPASS_OUT_I
LOWPASS_OUT_Q: U602.3(+IN) ; port LOWPASS_OUT_Q
RX_I: C601.2 R603.2 ; port RX_I
RX_Q: C603.2 R609.2 ; port RX_Q
NetC601_1: C601.1 R601.2
NetC602_1: C602.1 R602.1 R605.2 R606.1
NetC603_1: C603.1 R607.2
NetC604_1: C604.1 R608.1 R611.2 R612.1
NetR601_1: R601.1 R604.2 U601.1(VOUT)
NetR602_2: R602.2 R604.1 U601.4(-IN)
NetR607_1: R607.1 R610.2 U602.1(VOUT)
NetR608_2: R608.2 R610.1 U602.4(-IN)

### Notes on the sheet
- Amplifier (I)
- A = (R603 / R602) + 1
- (near C605) A = (30k / 1k) + 1 = 30dB
- A = (R609 / R608) + 1
- Amplifier (Q)
- (near C606) A = (30k / 1k) + 1 = 30dB
- NON_INVERTING AMPLIFIER I/Q
- (in symbol CMP-09116-000179-1) +; -

### Library data of the parts
C601-C606 = CAP_0805: Capacitor SMD 0805; Height: 0.94mm
R601-R612 = RES_0805: Resistor SMD 0805
U601 U602 = CMP-09116-000179-1: as U401 on sheet 04_DISCRETE_MIXER_IQ; Height: 1.3mm; Min Operating Temperature: -40°C; Mount: Surface Mount; Lead Free: Contains Lead; Gain Bandwidth Product: 200MHz; Contact Plating: Tin; Width: 1.7mm; Packaging: Cut Tape; Max Operating Temperature: 125°C; Case/Package: SOT-23-6; Number of Pins: 6; Length: 3mm; REACH SVHC: No SVHC; Max Supply Voltage: 11V; RoHS Compliant: Yes; Number of Amplifiers: 1; ComponentLink1Description: DigiKey; ComponentLink1URL: https://www.digikey.com/en/products/detail/analog-devices-inc/ADA4807-1ARJZ-R2/5057389

## Nets that join several sheets
+5: 01_TOP_LEVEL (5 pins), 03_DISCRETE_LNA (R301.2 R302.2), 04_DISCRETE_MIXER_IQ (13 pins), 05_LOWPASS_IQ (C505.2 C506.2 U501.6 U502.6), 06_AMPLIFIER_IQ (6 pins)
GND: 01_TOP_LEVEL (9 pins), 02_BANDPASS (C201.2 C203.2 L201.2 L203.2), 03_DISCRETE_LNA (7 pins), 04_DISCRETE_MIXER_IQ (21 pins), 05_LOWPASS_IQ (6 pins), 06_AMPLIFIER_IQ (10 pins)
/TXEN: 01_TOP_LEVEL (J103.1 R102.2), 04_DISCRETE_MIXER_IQ (R438.1 R439.1 U401.5 U402.5), 05_LOWPASS_IQ (U501.5 U502.5), 06_AMPLIFIER_IQ (U601.5 U602.5)
BANDPASS_OUT: 02_BANDPASS (C203.1 L202.2 L203.1 TP201.1), 03_DISCRETE_LNA (C305.1)
LNA_OUT_I_N: 03_DISCRETE_LNA (T301.6), 04_DISCRETE_MIXER_IQ (C406.2)
LNA_OUT_I_P: 03_DISCRETE_LNA (T301.4), 04_DISCRETE_MIXER_IQ (C405.2)
LNA_OUT_Q_N: 03_DISCRETE_LNA (T302.6), 04_DISCRETE_MIXER_IQ (C408.2)
LNA_OUT_Q_P: 03_DISCRETE_LNA (T302.4), 04_DISCRETE_MIXER_IQ (C407.2)
LO_F1_0_IN: 01_TOP_LEVEL (J103.2), 04_DISCRETE_MIXER_IQ (C413.1)
LO_F1_90_IN: 01_TOP_LEVEL (J103.3), 04_DISCRETE_MIXER_IQ (C414.1)
LOWPASS_OUT_I: 05_LOWPASS_IQ (C502.2 TP501.1 U501.1 U501.4), 06_AMPLIFIER_IQ (U601.3)
LOWPASS_OUT_Q: 05_LOWPASS_IQ (C504.2 TP502.1 U502.1 U502.4), 06_AMPLIFIER_IQ (U602.3)
MIXER_OUT_I: 04_DISCRETE_MIXER_IQ (R426.2 TP401.1 U401.1), 05_LOWPASS_IQ (R501.2)
MIXER_OUT_Q: 04_DISCRETE_MIXER_IQ (R427.2 TP402.1 U402.1), 05_LOWPASS_IQ (R503.2)
RX_I: 01_TOP_LEVEL (J101.1), 06_AMPLIFIER_IQ (C601.2 R603.2)
RX_Q: 01_TOP_LEVEL (J101.3), 06_AMPLIFIER_IQ (C603.2 R609.2)
RX_SIG_IN: 01_TOP_LEVEL (J102.1 J102.2), 02_BANDPASS (C201.1 C202.1 L201.1)